# EAGLE design PETHV (EAGLE 9.5.2)
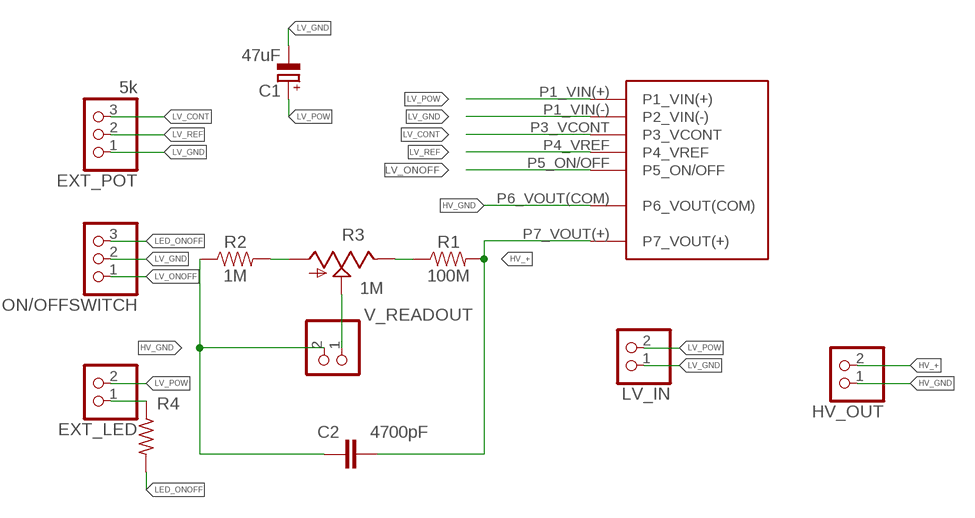
[diagram p0: schematic, sheet 1]

## Parts
C1  47uF  CPOL-EUE2.5-5  [E2,5-5]
C2  4700pF  C2.5/5  [C2.5-5]
EXT_LED  PINHD-1X2  [1X02]
EXT_POT  5k  PINHD-1X3  [1X03]
HV_OUT  PINHD-1X2  [1X02]
LV_IN  PINHD-1X2  [1X02]
ON/OFFSWITCH  PINHD-1X3  [1X03]
R1  100M  10MOHM-HORIZ-1/4W-5%  [AXIAL-0.3]
R2  1M  1MOHM-HORIZ-1/4W-5%  [AXIAL-0.3]
R3  1M  TRIM_US-B25P  [B25P]
R4  R-US_0204/7  [0204/7]
U$1  BELLNIX-MHV122.0K1000P  [BELLNIX-MHV12]
V_READOUT  PINHD-1X2  [1X02]

## Nets
HV_+: C2.2 HV_OUT.2 R1.P$2 U$1.P7_VOUT(+)
HV_GND: C2.1 HV_OUT.1 R2.P$1 U$1.P6_VOUT(COM) V_READOUT.2
LED_ONOFF: ON/OFFSWITCH.3 R4.2
LV_CONT: EXT_POT.3 U$1.P3_VCONT
LV_GND: C1.- EXT_POT.1 LV_IN.1 ON/OFFSWITCH.2 U$1.P1_VIN(-)(P2_VIN(-))
LV_ONOFF: ON/OFFSWITCH.1 U$1.P5_ON/OFF
LV_POW: C1.+ EXT_LED.2 LV_IN.2 U$1.P1_VIN(+)
LV_REF: EXT_POT.2 U$1.P4_VREF
N$1: R2.P$2 R3.A
N$4: EXT_LED.1 R4.1
N$6: R1.P$1 R3.E
N$7: R3.S V_READOUT.1

## Library data of the parts
C1 = rcl:CPOL-EU: POLARIZED CAPACITOR, European symbol; SPICEPREFIX: C
C2 = capacitor-wima:C: CAPACITOR naming: grid - package width
EXT_LED HV_OUT LV_IN V_READOUT = pinhead:PINHD-1X2: PIN HEADER
EXT_POT ON/OFFSWITCH = pinhead:PINHD-1X3: PIN HEADER
R1 = SparkFun-Resistors:10MOHM: RES-09327; PROD_ID: RES-09327; VALUE: 10M
R2 = SparkFun-Resistors:1MOHM: 1MΩ resistor A resistor is a passive two-terminal electrical component that implements electrical resistance as a circuit element. Resistors act to reduce current flow, and, at the same time, act to lower voltage levels within circuits. - Wikipedia; PROD_ID: RES-09329
R3 = pot:TRIM_US-: POTENTIOMETER
R4 = rcl:R-US_: RESISTOR, American symbol; SPICEPREFIX: R
U$1 = Bellnix MHV12:BELLNIX-MHV12

## Board
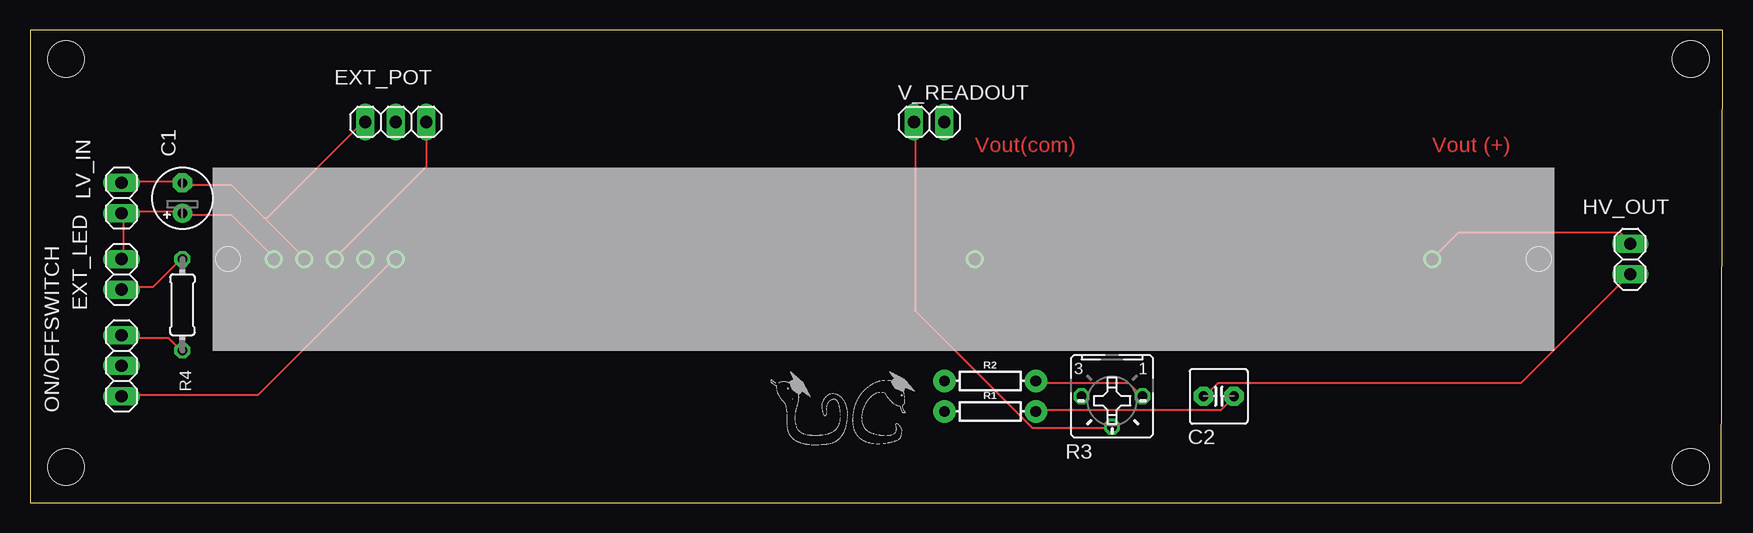
[diagram p1: board, top side]
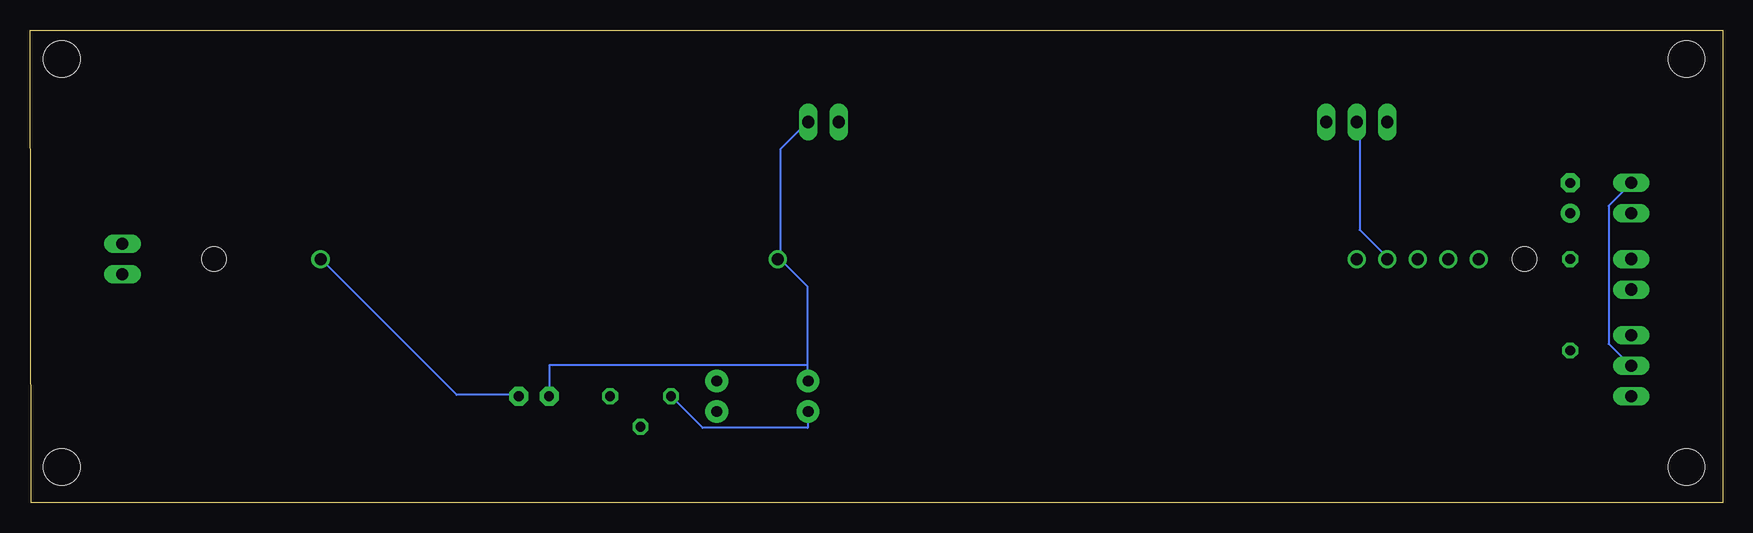
[diagram p2: board, bottom side, seen from below]

Size 141.05 x 39.41 mm. Coordinates in mm from the lower left corner, seen from the top.
Outline: 0,0 140.95,0 141.05,39.41 0,39.37 0,0
Copper layers (1*16): Top 0.035mm / dielectric 1.5mm / Bottom 0.035mm
Design rules "default": minimum track width 6mil, minimum drill 0.35mm, track to track 6mil, track to pad 6mil, pad to pad 6mil, via to via 6mil, smd to smd 6mil, copper to edge 40mil, drill to drill 6mil, minimum pad ring 10mil, minimum via ring 8mil, stop-mask expansion 4mil, vias tented up to drill 0mil, thermal gap 10mil
Holes 3.05 mm at 3,3 3,37 138.4,37 138.4,3

### Footprints (pad centres in the part's own frame; a part is rotated, then mirrored left to right if it is on the bottom)
E2,5-5 = drill 0.813 pad 1.6: + -1.27,0 | drill 0.813 pad 1.6 octagon: - 1.27,0
C2.5-5 = drill 0.813 pad 1.6 octagon: 1 -1.27,0; 2 1.27,0
1X02 = drill 1.016 long: 1 -1.27,0; 2 1.27,0
1X03 = drill 1.016 long: 1 -2.54,0; 2 0,0; 3 2.54,0
AXIAL-0.3 = drill 0.9 pad 1.88: P$1 -3.81,0; P$2 3.81,0
B25P = drill 0.813 octagon: A -2.54,0; E 2.54,0; S 0,2.54
0204/7 = drill 0.813 octagon: 1 -3.81,0; 2 3.81,0
BELLNIX-MHV12 = drill 1: P1_VIN(+) -50.8,0; P1_VIN(-) -48.26,0; P3_VCONT -45.72,0; P4_VREF -43.18,0; P5_ON/OFF -40.64,0; P6_VOUT(COM) 7.62,0; P7_VOUT(+) 45.72,0 | hole 2.032: -54.61,0; 54.61,0

### Placement (x,y rotation side)
C1  12.7,25.4 90 top
C2  99.06,8.89 0 top
EXT_LED  7.62,19.05 90 top
EXT_POT  30.48,31.75 0 top
HV_OUT  133.35,20.32 90 top
LV_IN  7.62,25.4 270 top
ON/OFFSWITCH  7.62,11.43 90 top
R1  80.01,7.62 0 top
R2  80.01,10.16 0 top
R3  90.17,8.89 180 top
R4  12.7,16.51 270 top
U$1  71.12,20.32 0 top
V_READOUT  74.93,31.75 0 top

### Tracks (layer width: path | path; a pad name or v marks a point on that pad's centre or on a via)
HV_+
  Top 0.152: U$1.P7_VOUT(+) 117,20.5 119,22.5 132.5,22.5 133.25,21.75 HV_OUT.2 | C2.2 100.25,8.75 99.25,7.75 84,7.75 R1.P$2
  Bottom 0.152: U$1.P7_VOUT(+) 116.75,20.25 105.5,9 100.5,9 C2.2
HV_GND
  Top 0.152: HV_OUT.1 133.25,19 124.25,10 99,10 98,9 C2.1
  Bottom 0.152: 76.25,11.5 76.25,10.25 R2.P$1 | 76.25,11.5 76.25,18 78.5,20.25 U$1.P6_VOUT(COM) 78.5,20.5 78.5,29.5 76.25,31.75 V_READOUT.2 | 76.25,11.5 97.75,11.5 97.75,9 C2.1
LED_ONOFF
  Top 0.152: R4.2 12.5,12.75 11.5,13.75 7.75,13.75 ON/OFFSWITCH.3
LV_CONT
  Top 0.152: U$1.P3_VCONT 25.5,20.5 33,28 33,31.75 EXT_POT.3
LV_GND
  Top 0.152: 19.5,23.75 16.75,26.5 12.75,26.5 C1.- 12.5,26.75 7.75,26.75 LV_IN.1 | 19.5,23.75 22.75,20.5 U$1.P1_VIN(-) | 19.5,23.75 19.75,23.75 27.75,31.75 EXT_POT.1
  Bottom 0.152: ON/OFFSWITCH.2 7.75,11.5 9.5,13.25 9.5,24.75 7.75,26.5 LV_IN.1
LV_ONOFF
  Top 0.152: U$1.P5_ON/OFF 30.25,20.25 19,9 7.75,9 ON/OFFSWITCH.1
LV_POW
  Top 0.152: EXT_LED.2 7.75,20.5 7.75,24 LV_IN.2 7.75,24.25 12.5,24.25 C1.+ 12.75,24 16.75,24 20.25,20.5 U$1.P1_VIN(+)
LV_REF
  Bottom 0.152: U$1.P4_VREF 28,20.5 30.25,22.75 30.25,31.75 EXT_POT.2
N$1
  Top 0.152: R3.A 92.5,9 91.5,10 84,10 R2.P$2
N$4
  Top 0.152: R4.1 12.5,20.25 10.25,18 7.78,18 7.65,17.78 EXT_LED.1
N$6
  Bottom 0.152: R3.E 87.5,8.75 85,6.25 76.25,6.25 76.25,7.5 R1.P$1
N$7
  Top 0.152: R3.S 90,6.25 83.5,6.25 73.75,16 73.75,31.75 V_READOUT.1